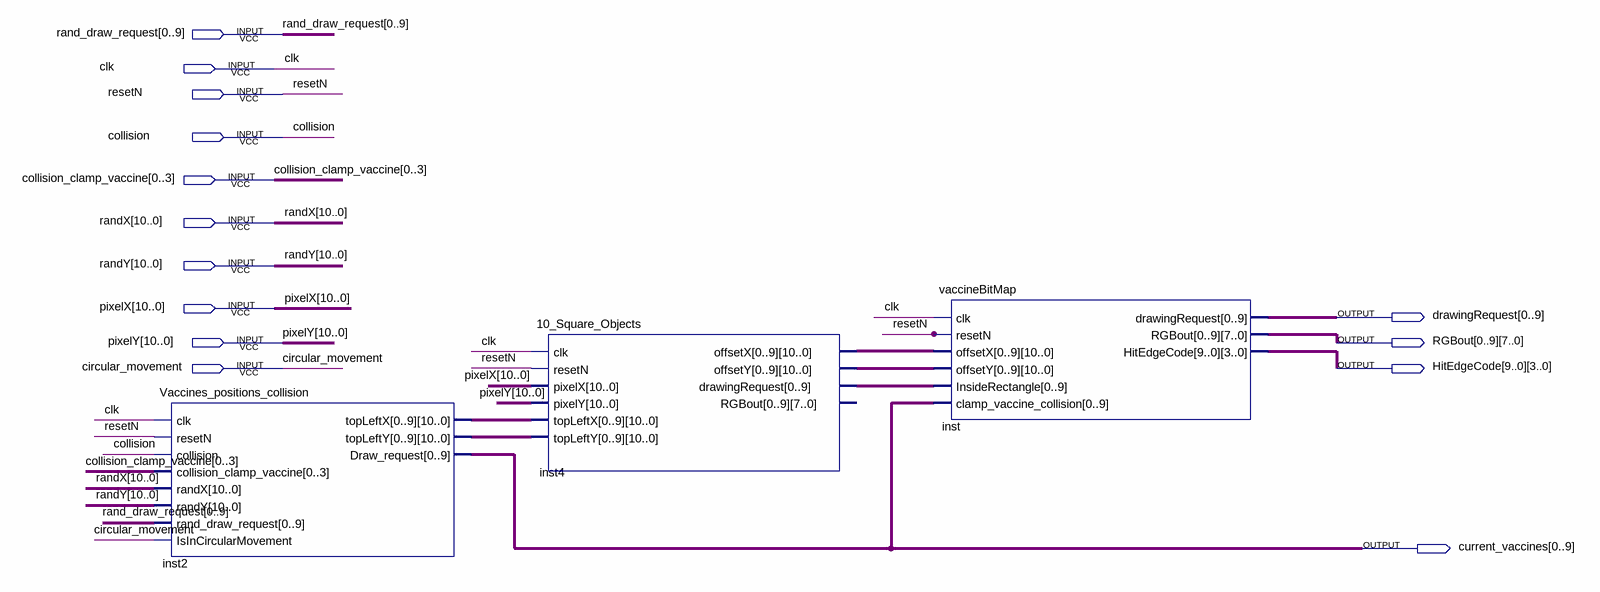
[diagram p0: schematic sheet]
// Quartus schematic vaccine_Block.bdf as structural Verilog: 3 symbols, 14 pins
module vaccine_Block (
  input  [0:9] rand_draw_request,
  input  clk,
  input  resetN,
  input  collision,
  input  [0:3] collision_clamp_vaccine,
  input  [10:0] randX,
  input  [10:0] randY,
  input  [10:0] pixelX,
  input  [10:0] pixelY,
  input  circular_movement,
  output [0:9] drawingRequest,
  output [7:0] RGBout_0,
  output [7:0] RGBout_1,
  output [7:0] RGBout_2,
  output [7:0] RGBout_3,
  output [7:0] RGBout_4,
  output [7:0] RGBout_5,
  output [7:0] RGBout_6,
  output [7:0] RGBout_7,
  output [7:0] RGBout_8,
  output [7:0] RGBout_9,
  output [3:0] HitEdgeCode_9,
  output [3:0] HitEdgeCode_8,
  output [3:0] HitEdgeCode_7,
  output [3:0] HitEdgeCode_6,
  output [3:0] HitEdgeCode_5,
  output [3:0] HitEdgeCode_4,
  output [3:0] HitEdgeCode_3,
  output [3:0] HitEdgeCode_2,
  output [3:0] HitEdgeCode_1,
  output [3:0] HitEdgeCode_0,
  output [0:9] current_vaccines
);

  wire [9:0] inst4_drawingrequest;
  wire [109:0] inst2_topleftx, inst2_toplefty, inst4_offsetx, inst4_offsety;

  Vaccines_positions_collision inst2 (
    .clk(clk), .resetN(resetN), .collision(collision), .collision_clamp_vaccine(collision_clamp_vaccine),
    .randX(randX), .randY(randY), .rand_draw_request(rand_draw_request),
    .IsInCircularMovement(circular_movement), .topLeftX(inst2_topleftx), .topLeftY(inst2_toplefty),
    .Draw_request(current_vaccines));
  \10_Square_Objects  inst4 (
    .clk(clk), .resetN(resetN), .pixelX(pixelX), .pixelY(pixelY), .topLeftX(inst2_topleftx),
    .topLeftY(inst2_toplefty), .offsetX(inst4_offsetx), .offsetY(inst4_offsety),
    .drawingRequest(inst4_drawingrequest));  // open: RGBout
  vaccineBitMap inst (
    .clk(clk), .resetN(resetN), .offsetX(inst4_offsetx), .offsetY(inst4_offsety),
    .InsideRectangle(inst4_drawingrequest), .clamp_vaccine_collision(current_vaccines),
    .drawingRequest(drawingRequest),
    .RGBout({RGBout_0, RGBout_1, RGBout_2, RGBout_3, RGBout_4, RGBout_5, RGBout_6, RGBout_7, RGBout_8, RGBout_9}),
    .HitEdgeCode({HitEdgeCode_9, HitEdgeCode_8, HitEdgeCode_7, HitEdgeCode_6, HitEdgeCode_5, HitEdgeCode_4, HitEdgeCode_3, HitEdgeCode_2, HitEdgeCode_1, HitEdgeCode_0}));
endmodule
